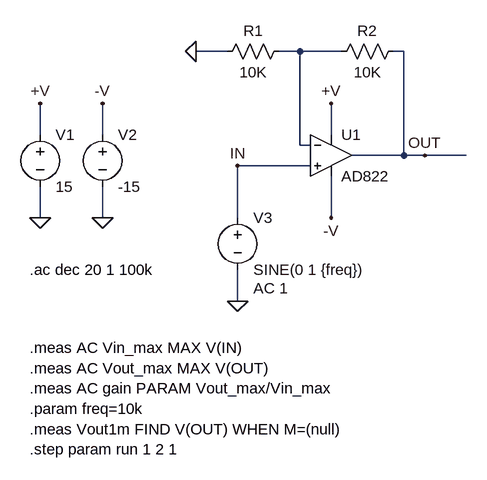
[diagram p0: schematic Draft1.asc]
Draft1.asc, the LTspice schematic file:
Version 4
SHEET 1 880 680
WIRE 336 -48 288 -48
WIRE 448 -48 416 -48
WIRE 512 -48 448 -48
WIRE 608 -48 592 -48
WIRE 48 80 48 32
WIRE 144 80 144 32
WIRE 496 80 496 32
WIRE 448 96 448 -48
WIRE 464 96 448 96
WIRE 608 112 608 -48
WIRE 608 112 528 112
WIRE 640 112 608 112
WIRE 704 112 640 112
WIRE 464 128 352 128
WIRE 48 208 48 160
WIRE 144 208 144 160
WIRE 352 208 352 128
WIRE 496 208 496 144
WIRE 352 336 352 288
FLAG 48 208 0
FLAG 144 208 0
FLAG 48 32 +V
FLAG 144 32 -V
FLAG 496 32 +V
FLAG 496 208 -V
FLAG 640 112 OUT
FLAG 352 336 0
FLAG 352 128 IN
FLAG 288 -48 0
SYMBOL voltage 48 64 R0
WINDOW 123 0 0 Left 0
WINDOW 39 0 0 Left 0
SYMATTR InstName V1
SYMATTR Value 15
SYMBOL voltage 144 64 R0
WINDOW 123 0 0 Left 0
WINDOW 39 0 0 Left 0
SYMATTR InstName V2
SYMATTR Value -15
SYMBOL OpAmps\\AD822 496 48 R0
SYMATTR InstName U1
SYMBOL res 432 -64 R90
WINDOW 0 0 56 VBottom 2
WINDOW 3 32 56 VTop 2
SYMATTR InstName R1
SYMATTR Value 10K
SYMBOL res 608 -64 R90
WINDOW 0 0 56 VBottom 2
WINDOW 3 32 56 VTop 2
SYMATTR InstName R2
SYMATTR Value 10K
SYMBOL voltage 352 192 R0
WINDOW 123 24 124 Left 2
WINDOW 39 0 0 Left 0
SYMATTR InstName V3
SYMATTR Value SINE(0 1 {freq})
SYMATTR Value2 AC 1
TEXT 32 288 Left 2 !.ac dec 20 1 100k
TEXT 32 408 Left 2 !.meas AC Vin_max MAX V(IN)\n.meas AC Vout_max MAX V(OUT)\n.meas AC gain PARAM Vout_max/Vin_max\n.param freq=10k\n.meas Vout1m FIND V(OUT) WHEN M=(null)\n.step param run 1 2 1

The netlist it stands for:
* Draft1.asc
V1 +V 0 15
V2 -V 0 -15
XU1 IN N001 +V -V OUT AD822  ; pins In+ In- V+ V- OUT
R1 N001 0 10K
R2 OUT N001 10K
V3 IN 0 SINE(0 1 {freq}) AC 1
.ac dec 20 1 100k
.meas AC Vin_max MAX V(IN)
.meas AC Vout_max MAX V(OUT)
.meas AC gain PARAM Vout_max/Vin_max
.param freq=10k
.meas Vout1m FIND V(OUT) WHEN M=(null)
.step param run 1 2 1
.backanno
.end